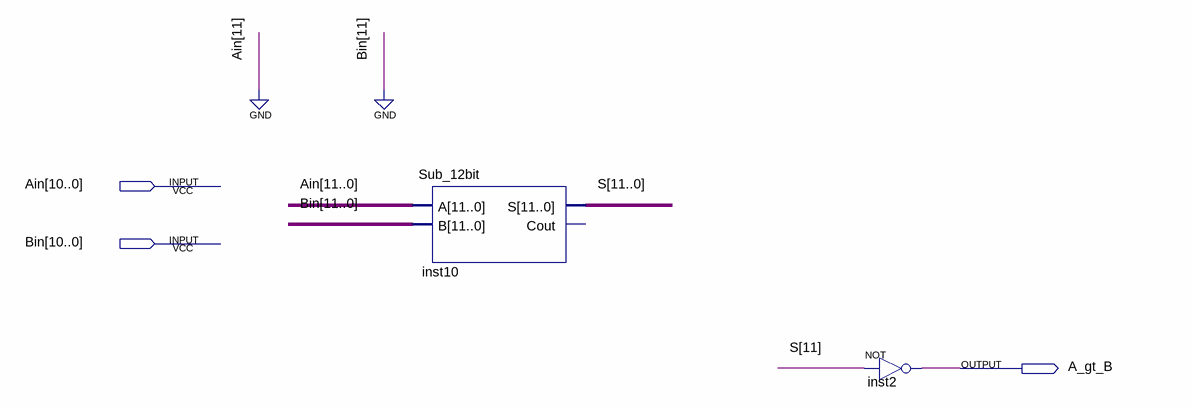
[diagram p0: schematic sheet]
// Quartus schematic Compare_11bit.bdf as structural Verilog: 2 symbols, 3 pins
module Compare_11bit (
  input  [10:0] Ain,
  input  [10:0] Bin,
  output A_gt_B
);

  wire [11:0] S;

  Sub_12bit inst10 (.A({1'b0, Ain}), .B({1'b0, Bin}), .S(S));  // open: Cout
  not inst2 (A_gt_B, S[11]);
endmodule
